# Altium project triumvi_integrated.PrjPcb
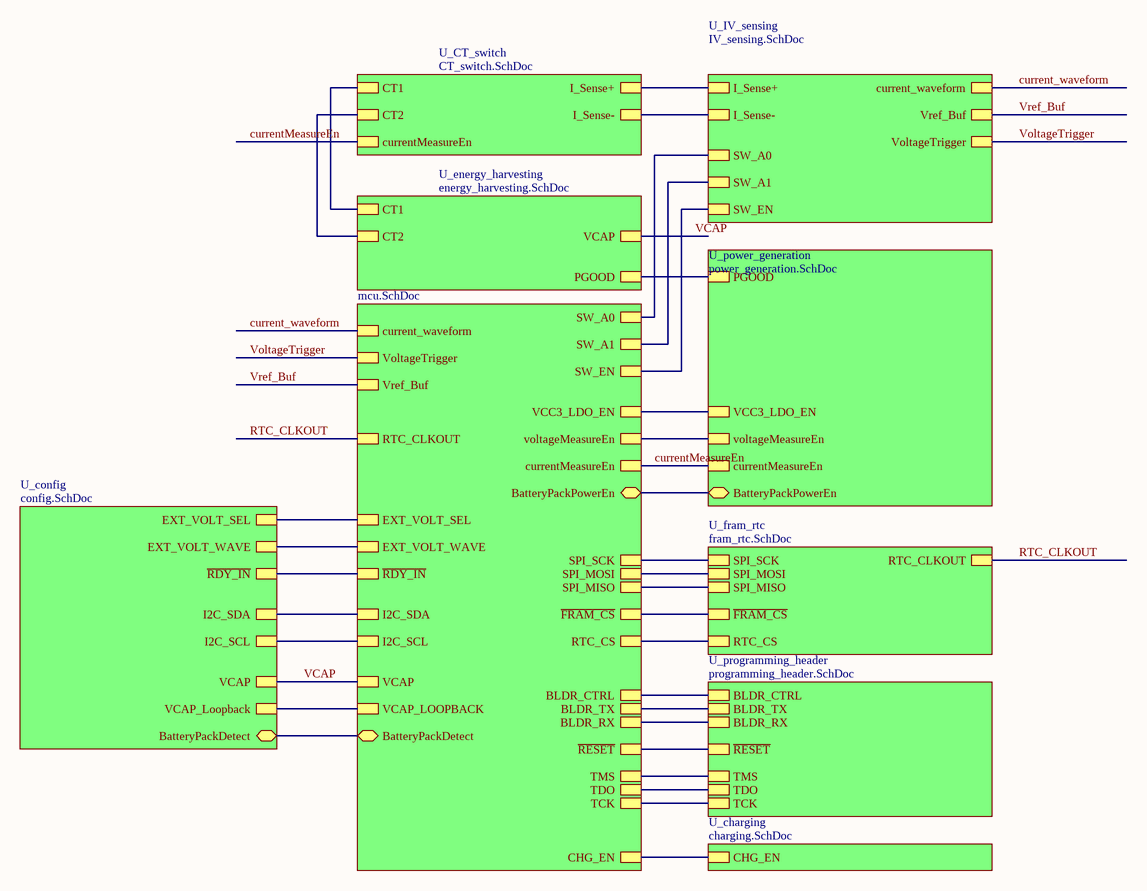
[diagram p0: top.SchDoc]
10 sheets, 152 parts. Net scope: hierarchical (ports join the sheet entries above them; power ports are global).
Board files: triumvi_integrated.PcbDoc, triumvi_integrated_array.PcbDoc, triumvi_integrated_small.PcbDoc
Sheets:
  top.SchDoc
    U_mcu = mcu.SchDoc
    U_charging = charging.SchDoc
    U_config = config.SchDoc
    U_CT_switch = CT_switch.SchDoc
    U_energy_harvesting = energy_harvesting.SchDoc
    U_fram_rtc = fram_rtc.SchDoc
    U_IV_sensing = IV_sensing.SchDoc
    U_power_generation = power_generation.SchDoc
    U_programming_header = programming_header.SchDoc

## Sheet top.SchDoc: Triumvi - Top
size Letter; Author: Ye-Sheng Kuo; Revision: 11; SheetNumber: 1; SheetTotal: 10

### Sub-sheets
U_charging = charging.SchDoc: CHG_EN
U_config = config.SchDoc: VCAP_Loopback, VCAP, EXT_VOLT_WAVE, EXT_VOLT_SEL, I2C_SDA, I2C_SCL, ~{RDY_IN}, BatteryPackDetect
U_CT_switch = CT_switch.SchDoc: CT1, CT2, currentMeasureEn, I_Sense+, I_Sense-
U_energy_harvesting = energy_harvesting.SchDoc: CT1, CT2, PGOOD, VCAP
U_fram_rtc = fram_rtc.SchDoc: SPI_MOSI, SPI_SCK, SPI_MISO, RTC_CS, ~{FRAM_CS}, RTC_CLKOUT
U_IV_sensing = IV_sensing.SchDoc: current_waveform, Vref_Buf, VoltageTrigger, I_Sense+, I_Sense-, SW_A0, SW_A1, SW_EN
U_mcu = mcu.SchDoc: current_waveform, Vref_Buf, voltageMeasureEn, currentMeasureEn, VoltageTrigger, ~{FRAM_CS}, SPI_SCK, SPI_MOSI, SPI_MISO, RTC_CS, I2C_SCL, I2C_SDA, EXT_VOLT_SEL, EXT_VOLT_WAVE, TDO, BLDR_CTRL, BLDR_TX, BLDR_RX, ~{RESET}, TMS, TCK, VCC3_LDO_EN, VCAP_LOOPBACK, VCAP, ~{RDY_IN}, SW_EN, RTC_CLKOUT, SW_A0, SW_A1, CHG_EN, BatteryPackPowerEn, BatteryPackDetect
U_power_generation = power_generation.SchDoc: PGOOD, VCC3_LDO_EN, voltageMeasureEn, currentMeasureEn, BatteryPackPowerEn
U_programming_header = programming_header.SchDoc: ~{RESET}, TMS, TCK, TDO, BLDR_CTRL, BLDR_TX, BLDR_RX

### Nets
BatteryPackDetect: sheet U_mcu/BatteryPackDetect, sheet U_config/BatteryPackDetect
BLD_CTRL: sheet U_mcu/BLDR_CTRL, sheet U_programming_header/BLDR_CTRL
BLD_RX: sheet U_mcu/BLDR_RX, sheet U_programming_header/BLDR_RX
BLD_TX: sheet U_mcu/BLDR_TX, sheet U_programming_header/BLDR_TX
CT1: sheet U_CT_switch/CT1, sheet U_energy_harvesting/CT1
CT2: sheet U_CT_switch/CT2, sheet U_energy_harvesting/CT2
current_waveform: sheet U_mcu/current_waveform, sheet U_IV_sensing/current_waveform
currentMeasureEn: sheet U_mcu/currentMeasureEn, sheet U_CT_switch/currentMeasureEn, sheet U_power_generation/currentMeasureEn
EXT_VOLT_SEL: sheet U_mcu/EXT_VOLT_SEL, sheet U_config/EXT_VOLT_SEL
EXT_VOLT_WAVE: sheet U_mcu/EXT_VOLT_WAVE, sheet U_config/EXT_VOLT_WAVE
I2C_SCL: sheet U_mcu/I2C_SCL, sheet U_config/I2C_SCL
I2C_SDA: sheet U_mcu/I2C_SDA, sheet U_config/I2C_SDA
in+: sheet U_CT_switch/I_Sense+, sheet U_IV_sensing/I_Sense+
in-: sheet U_CT_switch/I_Sense-, sheet U_IV_sensing/I_Sense-
PGOOD: sheet U_energy_harvesting/PGOOD, sheet U_power_generation/PGOOD
~{RDY_IN}: sheet U_mcu/~{RDY_IN}, sheet U_config/~{RDY_IN}
~{RESET}: sheet U_mcu/~{RESET}, sheet U_programming_header/~{RESET}
RTC_CLKOUT: sheet U_mcu/RTC_CLKOUT, sheet U_fram_rtc/RTC_CLKOUT
RTC_CS: sheet U_mcu/RTC_CS, sheet U_fram_rtc/RTC_CS
SPI_CLK: sheet U_mcu/SPI_SCK, sheet U_fram_rtc/SPI_SCK
SPI_MISO: sheet U_mcu/SPI_MISO, sheet U_fram_rtc/SPI_MISO
SPI_MOSI: sheet U_mcu/SPI_MOSI, sheet U_fram_rtc/SPI_MOSI
SW_A0: sheet U_mcu/SW_A0, sheet U_IV_sensing/SW_A0
SW_A1: sheet U_mcu/SW_A1, sheet U_IV_sensing/SW_A1
SW_EN: sheet U_mcu/SW_EN, sheet U_IV_sensing/SW_EN
TCK: sheet U_mcu/TCK, sheet U_programming_header/TCK
TDO: sheet U_mcu/TDO, sheet U_programming_header/TDO
TMS: sheet U_mcu/TMS, sheet U_programming_header/TMS
VCAP: sheet U_mcu/VCAP, sheet U_config/VCAP, sheet U_energy_harvesting/VCAP
VCAP_LOOPBACK: sheet U_mcu/VCAP_LOOPBACK, sheet U_config/VCAP_Loopback
voltageMeasureEn: sheet U_mcu/voltageMeasureEn, sheet U_power_generation/voltageMeasureEn
VoltageTrigger: sheet U_mcu/VoltageTrigger, sheet U_IV_sensing/VoltageTrigger
Vref_Buf: sheet U_mcu/Vref_Buf, sheet U_IV_sensing/Vref_Buf
NetQ13_5: sheet U_mcu/BatteryPackPowerEn, sheet U_power_generation/BatteryPackPowerEn
NetR4_1: sheet U_mcu/CHG_EN, sheet U_charging/CHG_EN
NetU5_1: sheet U_mcu/~{FRAM_CS}, sheet U_fram_rtc/~{FRAM_CS}
NetU10_11: sheet U_mcu/VCC3_LDO_EN, sheet U_power_generation/VCC3_LDO_EN

### Notes on the sheet
- Title
- Date:
- Author:
- Revision:
- Sheet
- of
- University of Michigan
- File:

## Sheet mcu.SchDoc: Triumvi - CC2538
size Letter; Author: Ye-Sheng Kuo; Revision: 11; SheetNumber: 7; SheetTotal: 10
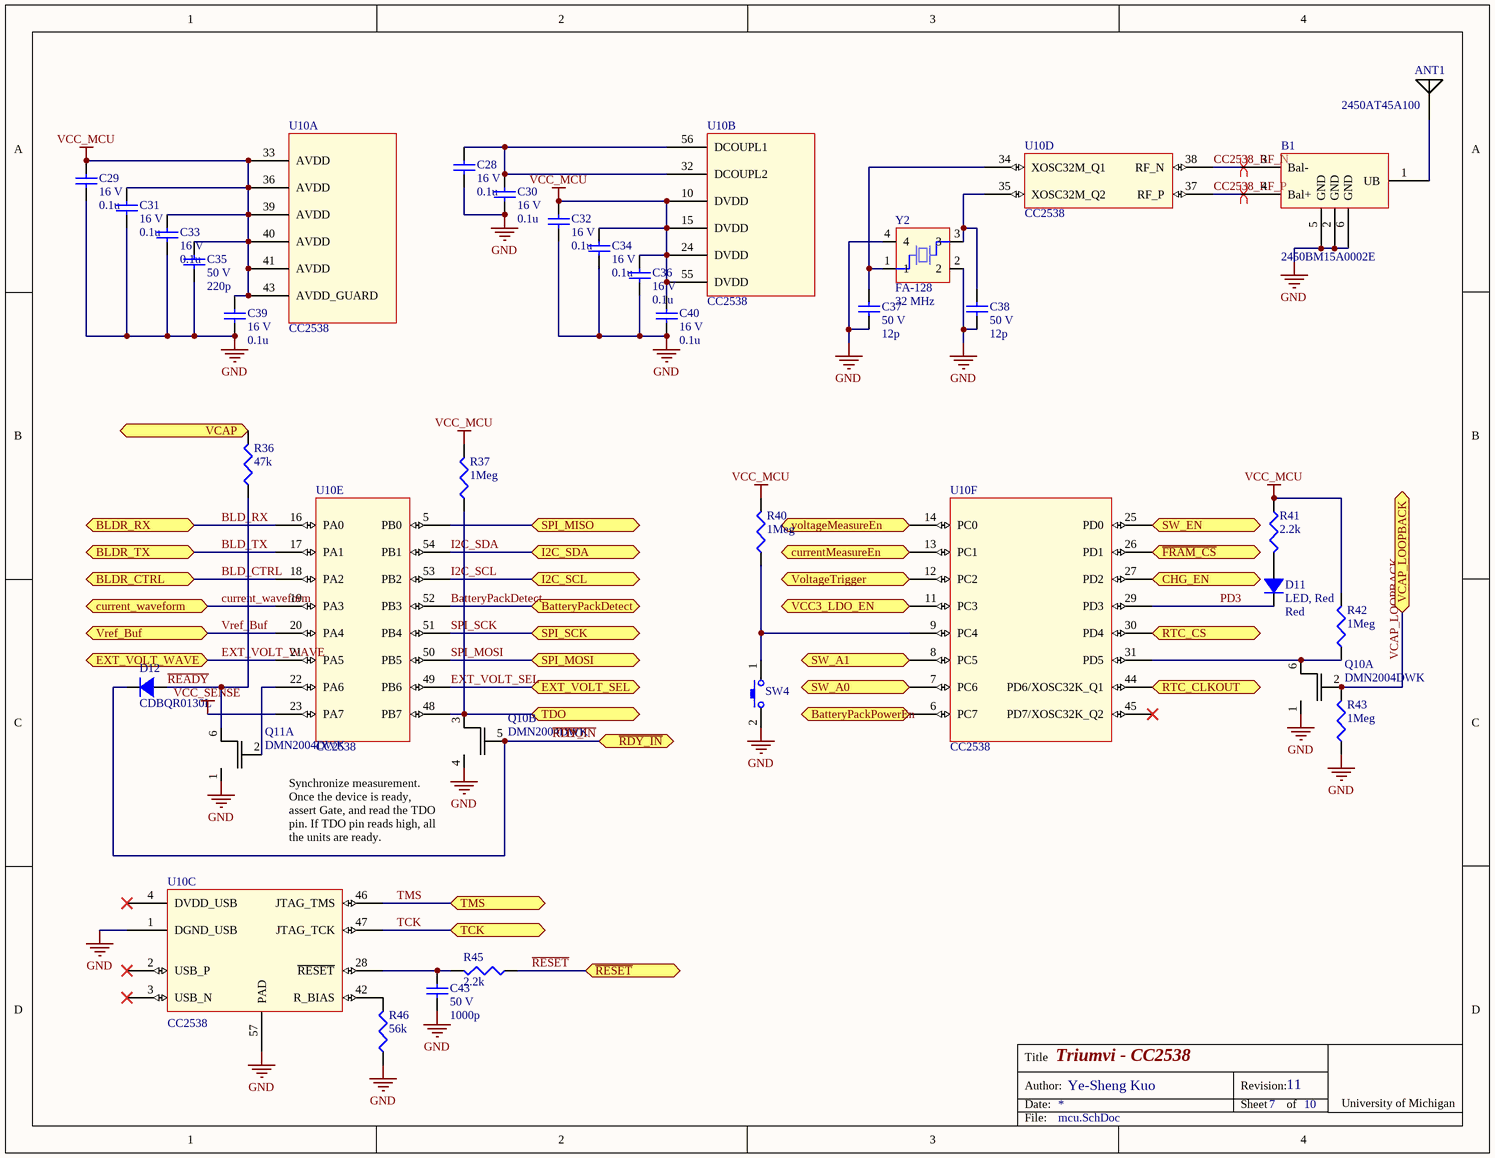
[diagram p1: mcu.SchDoc]

### Parts
ANT1  2450AT45A100  [2450AT45A100]
B1  2450BM15A0002E  [2450BM15A0002]
C28  voltage rated: 16 V  [0402]  (hidden comment: 0.1u)
C29  voltage rated: 16 V  [0402]  (hidden comment: 0.1u)
C30  voltage rated: 16 V  [0402]  (hidden comment: 0.1u)
C31  voltage rated: 16 V  [0402]  (hidden comment: 0.1u)
C32  voltage rated: 16 V  [0402]  (hidden comment: 0.1u)
C33  voltage rated: 16 V  [0402]  (hidden comment: 0.1u)
C34  voltage rated: 16 V  [0402]  (hidden comment: 0.1u)
C35  voltage rated: 50 V  [0402]  (hidden comment: 220p)
C36  voltage rated: 16 V  [0402]  (hidden comment: 0.1u)
C37  voltage rated: 50 V  [0402]  (hidden comment: 12p)
C38  voltage rated: 50 V  [0402]  (hidden comment: 12p)
C39  voltage rated: 16 V  [0402]  (hidden comment: 0.1u)
C40  voltage rated: 16 V  [0402]  (hidden comment: 0.1u)
C43  voltage rated: 50 V  [0402]  (hidden comment: 1000p)
D11  LED, Red  value Red  [0402 - LED]
D12  CDBQR0130L  [0402 - DIODE]
Q10  DMN2004DWK  [SC70-6]  (parts A,B of 2)
Q11  DMN2004DWK  [SC70-6]  (part A of 2)
R36  47k  [0402]
R37  1Meg  [0402]
R40  1Meg  [0402]
R41  2.2k  [0402]
R42  1Meg  [0402]
R43  1Meg  [0402]
R45  2.2k  [0402]
R46  56k  [0402]
SW4  EVQP7C  [EVQP7C]  (value not drawn)
U10  CC2538  [QFN56]  (parts A,B,C,D,E,F of 6)
Y2  FA-128  frequency: 32 MHz  [FA-128]

### Ports
BatteryPackDetect, BatteryPackPowerEn, BLDR_CTRL, BLDR_RX, BLDR_TX, CHG_EN, current_waveform, currentMeasureEn, EXT_VOLT_SEL, EXT_VOLT_WAVE, I2C_SCL, I2C_SDA, RTC_CLKOUT, RTC_CS, SPI_MISO, SPI_MOSI, SPI_SCK, SW_A0, SW_A1, SW_EN, TCK, TDO, TMS, VCAP, VCAP_LOOPBACK, VCC3_LDO_EN, voltageMeasureEn, VoltageTrigger, Vref_Buf, ~{FRAM_CS}, ~{RDY_IN}, ~{RESET}

### Nets
GND: B1.2(GND) B1.5(GND) B1.6(GND) C28.2 C29.2 C30.2 C31.2 C32.2 C33.2 C34.2 C35.2 C36.2 C37.2 C38.2 C39.2 C40.2 C43.2 Q10.1(S2) Q10.4(S1) Q11.1(S2) R43.2 R46.2 SW4.2 U10.1(DGND_USB) U10.57(PAD) Y2.2 Y2.4
VCC_MCU: C29.1 C31.1 C32.1 C33.1 C34.1 C35.1 C36.1 C39.1 C40.1 R37.1 R40.1 R41.2 R42.1 U10.10(DVDD) U10.15(DVDD) U10.24(DVDD) U10.33(AVDD) U10.36(AVDD) U10.39(AVDD) U10.40(AVDD) U10.41(AVDD) U10.43(AVDD_GUARD) U10.55(DVDD)
VCC_SENSE: U10.23(PA7)
BatteryPackDetect: U10.52(PB3) ; port BatteryPackDetect
BLD_CTRL: U10.18(PA2) ; port BLDR_CTRL
BLD_RX: U10.16(PA0) ; port BLDR_RX
BLD_TX: U10.17(PA1) ; port BLDR_TX
CC2538_RF_N: B1.3(Bal-) U10.38(RF_N)
CC2538_RF_P: B1.4(Bal+) U10.37(RF_P)
current_waveform: U10.19(PA3) ; port current_waveform
currentMeasureEn: U10.13(PC1) ; port currentMeasureEn
EXT_VOLT_SEL: U10.49(PB6) ; port EXT_VOLT_SEL
EXT_VOLT_WAVE: U10.21(PA5) ; port EXT_VOLT_WAVE
I2C_SCL: U10.53(PB2) ; port I2C_SCL
I2C_SDA: U10.54(PB1) ; port I2C_SDA
PD3: D11.2 U10.29(PD3)
~{RDY_IN}: D12.2 Q10.5(G1) ; port ~{RDY_IN}  [also labelled TDO]
~{READY}: D12.1 Q11.6(D2) R36.2
~{RESET}: R45.2 ; port ~{RESET}
RTC_CLKOUT: U10.44(PD6/XOSC32K_Q1) ; port RTC_CLKOUT
RTC_CS: U10.30(PD4) ; port RTC_CS
SPI_MISO: U10.5(PB0) ; port SPI_MISO
SPI_MOSI: U10.50(PB5) ; port SPI_MOSI
SPI_SCK: U10.51(PB4) ; port SPI_SCK  [project net SPI_CLK]
SW_A0: U10.7(PC6) ; port SW_A0
SW_A1: U10.8(PC5) ; port SW_A1
SW_EN: U10.25(PD0) ; port SW_EN
TCK: U10.47(JTAG_TCK) ; port TCK
TDO: Q10.3(D1) R37.2 U10.48(PB7) ; port TDO
TMS: U10.46(JTAG_TMS) ; port TMS
VCAP: R36.1 ; port VCAP
VCAP_LOOPBACK: Q10.2(G2) R43.1 ; port VCAP_LOOPBACK
voltageMeasureEn: U10.14(PC0) ; port voltageMeasureEn
VoltageTrigger: U10.12(PC2) ; port VoltageTrigger
Vref_Buf: U10.20(PA4) ; port Vref_Buf
NetANT1_1: ANT1.1 B1.1(UB)
NetC28_1: C28.1 C30.1 U10.32(DCOUPL2) U10.56(DCOUPL1)
NetC37_1: C37.1 U10.34(XOSC32M_Q1) Y2.1
NetC38_1: C38.1 U10.35(XOSC32M_Q2) Y2.3
NetC43_1: C43.1 R45.1 U10.28(~{RESET})
NetD11_1: D11.1 R41.1
NetQ10_6: Q10.6(D2) R42.2 U10.31(PD5)
NetQ11_2: Q11.2(G2) U10.22(PA6)
NetQ13_5: U10.6(PC7) ; port BatteryPackPowerEn
NetR4_1: U10.27(PD2) ; port CHG_EN
NetR40_2: R40.2 SW4.1 U10.9(PC4)
NetR46_1: R46.1 U10.42(R_BIAS)
NetU5_1: U10.26(PD1) ; port ~{FRAM_CS}
NetU10_11: U10.11(PC3) ; port VCC3_LDO_EN

Not connected (* = marked no-connect by the designer): U10 2(USB_P)* 3(USB_N)* 4(DVDD_USB)* 45(PD7/XOSC32K_Q2)*

### Layout directives
differential pair: CC2538_RF_N, CC2538_RF_P

### Notes on the sheet
- Synchronize measurement. Once the device is ready, assert Gate, and read the TDO pin. If TDO pin reads high, all the units are ready.
- Title
- Date:
- Author:
- Revision:
- Sheet
- of
- University of Michigan
- File:

### Library data of the parts
ANT1 = 2450AT45A100: 2.45 GHz High Gain SMD Chip Antenna; Supplier 1: Digi-Key; Supplier Part Number 1: 712-1012-1-ND
B1 = 2450BM15A0002E: 2.45 GHz Balun for TI CC253X; Supplier 1: Digi-Key; Supplier Part Number 1: 712-1536-1-ND
C28-C34 C36 C39 C40 = GRM155R71C104KA88D: 0.10µF ±10% 16V Ceramic Capacitor X7R 0402; Manufacture: Murata; tolerance: 10%; package: 0402; Supplier 1: Digi-Key; Supplier Part Number 1: 490-3261-1-ND; Value: 0.1u; Temperature Coefficient: X7R; Manufacturer Part Number: GRM155R71C104KA88D
C35 = C0402C221K5RACTU: 220pF ±10% 50V Ceramic Capacitor X7R 0402; Manufacture: Kemet; tolerance: 10%; package: 0402; Supplier 1: Digi-Key; Supplier Part Number 1: 399-1030-1-ND; Value: 220p; Temperature Coefficient: X7R; Manufacturer Part Number: C0402C221K5RACTU
C37 C38 = 500R07S120GV4T: 12pF ±2% 50V Ceramic Capacitor C0G, NP0 0402; Manufacture: Johanson Technology Inc.; tolerance: 2%; package: 0402; Temperature Coefficient: C0G, NP0; Manufacturer Part Number: 500R07S120GV4T; Supplier 1: Digi-Key; Supplier Part Number 1: 712-1256-1-ND; Value: 12p
C43 = C1005C0G1H102J050BA: 1000pF ±5% 50V Ceramic Capacitor C0G, NP0 0402; Manufacture: TDK; tolerance: 5%; package: 0402; Supplier 1: Digi-Key; Supplier Part Number 1: 445-6846-1-ND; Value: 1000p; Temperature Coefficient: C0G, NP0; Manufacturer Part Number: C1005C0G1H102J050BA
D11 = SML-P12UTT86: Red 620nm LED Indication - Discrete 2V 2-SMD; Manufacturer: Rohm Semiconductor; Current @ VF: 20 mA; package: 0402; Supplier 1: Digi-Key; Supplier Part Number 1: 511-1593-1-ND; Forward Voltage: 2 V; Manufacturer Part Number: SML-P12UTT86; Wavelength: 620 nm
D12 = CDBQR0130L: Diode Schottky 30V 100mA Surface Mount 0402/SOD-923F; Manufacturer: Comchip Technology; Forward Voltage @ If: 350 mV @ 10 mA; Supplier 1: Digi-Key; Supplier Part Number 1: 641-1271-1-ND; Manufacturer Part Number: CDBQR0130L; current: 100 mA; reverse voltage: 30 V; diode type: Schottky
Q10 Q11 = DMN2004DWK: DUAL N-CHANNEL ENHANCEMENT MODE MOSFET; Supplier 1: Digi-Key; Supplier Part Number 1: DMN2004DWKDICT-ND
R36 = CRCW040247K0FKED: RES SMD 47K OHM 1% 1/16W 0402; Manufacturer: Vishay Dale; Temperature Coefficient: 100 ppm/C; Tolerance: 1%; Power: 1/16 W; package: 0402; Supplier 1: Digi-Key; Supplier Part Number 1: 541-47.0KLCT-ND; value: 47k; Manufacturer Part Number: CRCW040247K0FKED
R37 R40 R42 R43 = CRCW04021M00FKED: RES SMD 1M OHM 1% 1/16W 0402; Manufacturer: Vishay Dale; Temperature Coefficient: 100 ppm/C; Tolerance: 1%; Power: 1/16 W; Supplier 1: Digi-Key; Supplier Part Number 1: 541-1.00MLCT-ND; package: 0402; value: 1Meg; Manufacturer Part Number: CRCW04021M00FKED
R41 R45 = CRCW04022K20FKED: RES SMD 2.2K OHM 1% 1/16W 0402; Manufacturer: Vishay Dale; Temperature Coefficient: 100 ppm/C; Tolerance: 1%; Power: 1/16 W; package: 0402; Supplier 1: Digi-Key; Supplier Part Number 1: 541-2.20KLCT-ND; value: 2.2k; Manufacturer Part Number: CRCW04022K20FKED
R46 = CRCW040256K0FKED: RES SMD 56K OHM 1% 1/16W 0402; Manufacturer: Vishay Dale; Temperature Coefficient: 100 ppm/C; Power: 1/16 W; package: 0402; Supplier 1: Digi-Key; Supplier Part Number 1: 541-56.0KLCT-ND; Tolerance: 1%; value: 56k; Manufacturer Part Number: CRCW040256K0FKED
SW4 = EVQP7C: 3.5 mm×2.9 mm Side-operational SMD  Light Touch Switches; Supplier 1: Digi-Key; Supplier Part Number 1: P16769CT-ND
U10 = CC2538: A Powerful System-On-Chip for 2.4-GHz IEEE 802.15.4, 6LoWPAN  and ZigBee Applications; Supplier 1: Digi-Key; Supplier Part Number 1: 296-35797-1-ND
Y2 = FA-128: MHz Range Crystal Unit; Load capatance: 10 pF; ESR: 60; stability: 20 ppm; Supplier 1: Digi-Key; Supplier Part Number 1: SER3800CT-ND

## Sheet charging.SchDoc: Triumvi - Charging
size Letter; Author: Ye-Sheng Kuo; Revision: 11; SheetNumber: 6; SheetTotal: 10
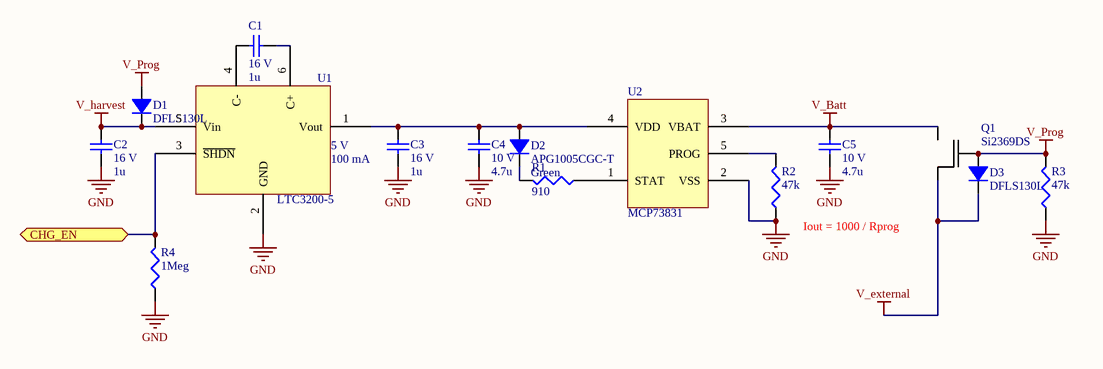
[diagram p2: charging.SchDoc]

### Parts
C1  voltage rated: 16 V  [0603]  (hidden comment: 1u)
C2  voltage rated: 16 V  [0603]  (hidden comment: 1u)
C3  voltage rated: 16 V  [0603]  (hidden comment: 1u)
C4  voltage rated: 10 V  [0603]  (hidden comment: 4.7u)
C5  voltage rated: 10 V  [0603]  (hidden comment: 4.7u)
D1  DFLS130L  [PowerDI123]
D2  APG1005CGC-T  value Green  [0402 - LED]
D3  DFLS130L  [PowerDI123]
Q1  Si2369DS  [SOT23-3]
R1  910  [0402]
R2  47k  [0402]
R3  47k  [0402]
R4  1Meg  [0402]
U1  LTC3200-5  Vout: 5 V  Iout: 100 mA  [SOT23-6]
U2  MCP73831  [TSOT23-5]

### Ports
CHG_EN

### Nets
GND: C2.1 C3.1 C4.2 C5.2 R2.2 R3.2 R4.2 U1.2(GND) U2.2(VSS)
V_Batt: C5.1 Q1.2(S) U2.3(VBAT)
V_external: D3.2 Q1.3(D)
V_harvest: C2.2 D1.2 U1.5(Vin)
V_Prog: D1.1 D3.1 Q1.1(G) R3.1
NetC1_1: C1.1 U1.4(C-)
NetC1_2: C1.2 U1.6(C+)
NetC3_2: C3.2 C4.1 D2.1 U1.1(Vout) U2.4(VDD)
NetD2_2: D2.2 R1.1
NetR1_2: R1.2 U2.1(STAT)
NetR2_1: R2.1 U2.5(PROG)
NetR4_1: R4.1 U1.3(~{SHDN}) ; port CHG_EN

### Notes on the sheet
- (near R2) Iout = 1000 / Rprog
- Title
- Date:
- Author:
- Revision:
- Sheet
- of
- University of Michigan
- File:

### Library data of the parts
C1-C3 = C1608X7R1C105K080AC: 1µF ±10% 16V Ceramic Capacitor X7R 0603; Manufacture: TDK; tolerance: 10%; package: 0603; Temperature Coefficient: X7R; Manufacturer Part Number: C1608X7R1C105K080AC; Supplier 1: Digi-Key; Supplier Part Number 1: 445-1604-1-ND; Value: 1u
C4 C5 = CGB3B1X5R1A475K055AC: 4.7µF ±10% 10V Ceramic Capacitor X5R 0603; Manufacture: TDK; tolerance: 10%; package: 0603; Supplier 1: Digi-Key; Supplier Part Number 1: 445-7482-1-ND; Value: 4.7u; Temperature Coefficient: X5R; Manufacturer Part Number: CGB3B1X5R1A475K055AC
D1 D3 = DFLS130L: 1.0A SURFACE MOUNT SCHOTTKY BARRIER RECTIFIER; Manufacturer: Diodes Incorporated; Forward Voltage @ If: 0.21 V @ 0.1 A; reverse current: 0.26 mA @ 5V; power: 556 mW; Manufacturer Part Number: DFLS130L; diode type: SCHOTTKY BARRIER; Supplier 1: Digi-Key; Supplier Part Number 1: DFLS130LDICT-ND
D2 = APG1005CGC-T: Green 571nm LED Indication - Discrete 2V 0402 (1005 Metric); Manufacturer: Kingbright; Current @ VF: 20 mA; package: 0402; Forward Voltage: 2 V; Manufacturer Part Number: APG1005CGC-T; Wavelength: 571 nm; Supplier 1: Digi-Key; Supplier Part Number 1: 754-1811-1-ND
Q1 = Si2369DS: P-Channel 30-V (D-S) MOSFET; Supplier 1: Digi-Key; Supplier Part Number 1: SI2369DS-T1-GE3CT-ND
R1 = CRCW0402910RFKED: RES SMD 910 OHM 1% 1/16W 0402; Manufacturer: Vishay Dale; Temperature Coefficient: 100 ppm/C; Tolerance: 1%; Power: 1/16 W; package: 0402; Supplier 1: Digi-Key; Supplier Part Number 1: 541-910LCT-ND; value: 910; Manufacturer Part Number: CRCW0402910RFKED
R2 R3 = CRCW040247K0FKED: as R36 on sheet mcu; Tolerance: 1%; Power: 1/16 W; package: 0402; Supplier 1: Digi-Key; Supplier Part Number 1: 541-47.0KLCT-ND; value: 47k; Manufacturer Part Number: CRCW040247K0FKED
R4 = CRCW04021M00FKED: as R37 on sheet mcu; Tolerance: 1%; Power: 1/16 W; Supplier 1: Digi-Key; Supplier Part Number 1: 541-1.00MLCT-ND; package: 0402; value: 1Meg; Manufacturer Part Number: CRCW04021M00FKED
U1 = LTC3200ES6-5#TRMPBF: Low Noise, Regulated   Charge Pump DC/DC Converters; Supplier 1: Digi-Key; Supplier Part Number 1: LTC3200ES6-5#TRMPBFCT-ND
U2 = MCP73831: Miniature Single-Cell, Fully Integrated Li-Ion,  Li-Polymer Charge Management Controllers; Supplier 1: Digi-Key; Supplier Part Number 1: MCP73831T-2ATI/OTCT-ND

## Sheet config.SchDoc: Triumvi - Configuring
size Letter; Author: Ye-Sheng Kuo; Revision: 11; SheetNumber: 8; SheetTotal: 10
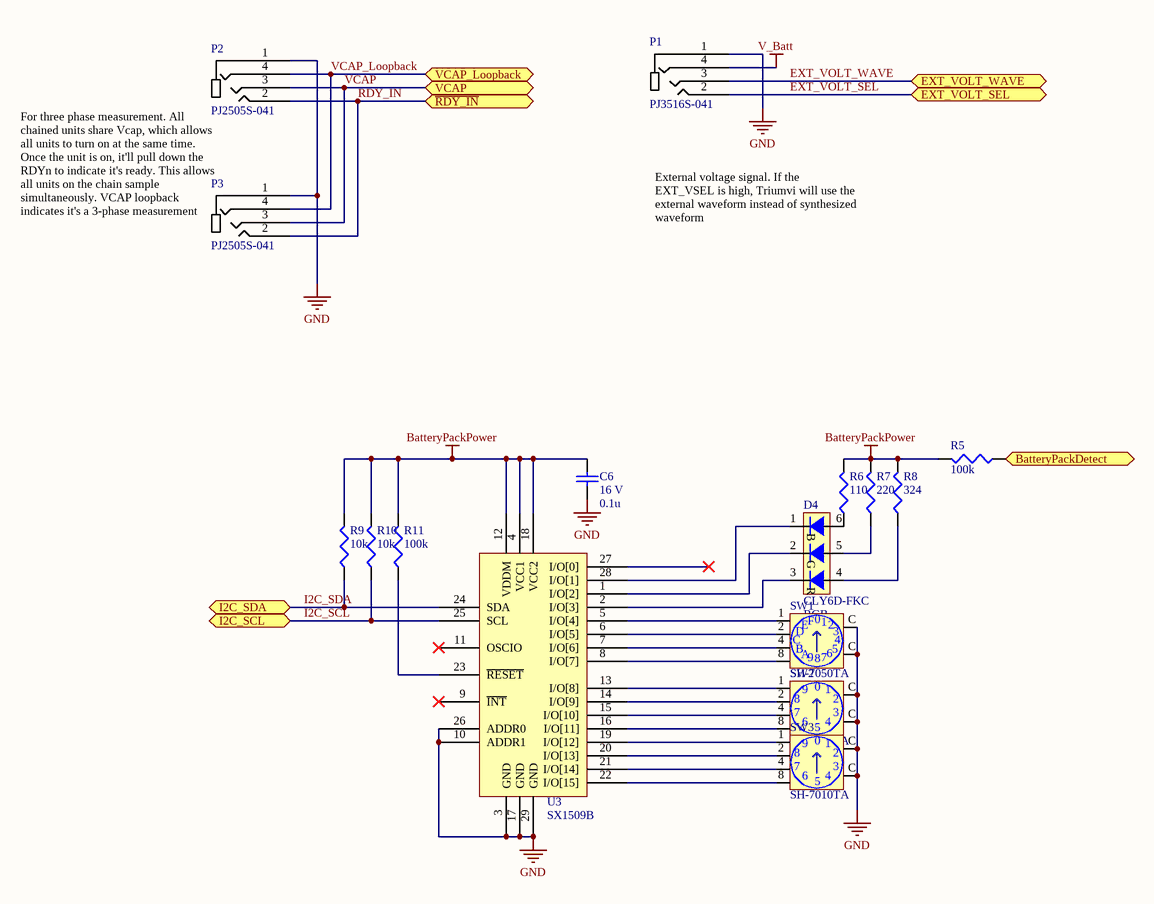
[diagram p3: config.SchDoc]

### Parts
C6  voltage rated: 16 V  [0402]  (hidden comment: 0.1u)
D4  CLY6D-FKC  value RGB  [PLCC6]
P1  PJ3516S-041  [PJ3516S-041]
P2  PJ2505S-041  [PJ2505S-041]
P3  PJ2505S-041  [PJ2505S-041]
R5  100k  [0402]
R6  110  [0402]
R7  220  [0402]
R8  324  [0402]
R9  10k  [0402]
R10  10k  [0402]
R11  100k  [0402]
SW1  SH-7050TA  [SH-7050A]
SW2  SH-7010TA  [SH-7010A]
SW3  SH-7010TA  [SH-7010A]
U3  SX1509B  [QFN40P400X400X60_HS-29N]

### Ports
BatteryPackDetect, EXT_VOLT_SEL, EXT_VOLT_WAVE, I2C_SCL, I2C_SDA, VCAP, VCAP_Loopback, ~{RDY_IN}

### Nets
BatteryPackPower: C6.1 R5.1 R6.1 R7.1 R8.1 R9.1 R10.1 R11.1 U3.4(VCC1) U3.12(VDDM) U3.18(VCC2)
GND: C6.2 P1.1 P2.1 P3.1 SW1.C SW2.C SW3.C U3.3(GND) U3.10(ADDR1) U3.17(GND) U3.26(ADDR0) U3.29(GND)
V_Batt: P1.4
BatteryPackDetect: R5.2 ; port BatteryPackDetect
EXT_VOLT_SEL: P1.2 ; port EXT_VOLT_SEL
EXT_VOLT_WAVE: P1.3 ; port EXT_VOLT_WAVE
I2C_SCL: R10.2 U3.25(SCL) ; port I2C_SCL
I2C_SDA: R9.2 U3.24(SDA) ; port I2C_SDA
~{RDY_IN}: P2.2 P3.2 ; port ~{RDY_IN}
VCAP: P2.3 P3.3 ; port VCAP
VCAP_LOOPBACK: P2.4 P3.4 ; port VCAP_Loopback
NetD4_1: D4.1 U3.28(I/O[1])
NetD4_2: D4.2 U3.1(I/O[2])
NetD4_3: D4.3 U3.2(I/O[3])
NetD4_4: D4.4 R8.2
NetD4_5: D4.5 R7.2
NetD4_6: D4.6 R6.2
NetR11_2: R11.2 U3.23(~{RESET})
NetSW1_1: SW1.1 U3.5(I/O[4])
NetSW1_2: SW1.2 U3.6(I/O[5])
NetSW1_4: SW1.4 U3.7(I/O[6])
NetSW1_8: SW1.8 U3.8(I/O[7])
NetSW2_1: SW2.1 U3.13(I/O[8])
NetSW2_2: SW2.2 U3.14(I/O[9])
NetSW2_4: SW2.4 U3.15(I/O[10])
NetSW2_8: SW2.8 U3.16(I/O[11])
NetSW3_1: SW3.1 U3.19(I/O[12])
NetSW3_2: SW3.2 U3.20(I/O[13])
NetSW3_4: SW3.4 U3.21(I/O[14])
NetSW3_8: SW3.8 U3.22(I/O[15])

Not connected (* = marked no-connect by the designer): U3 9(~{INT})* 11(OSCIO)* 27(I/O[0])*

### Notes on the sheet
- For three phase measurement. All chained units share Vcap, which allows all units to turn on at the same time. Once the unit is on, it'll pull down the RDYn to indicate it's ready. This allows all units on the chain sample simultaneously. VCAP loopback indicates it's a 3-phase measurement
- External voltage signal. If the EXT_VSEL is high, Triumvi will use the external waveform instead of synthesized waveform
- Title
- Date:
- Author:
- Revision:
- Sheet
- of
- University of Michigan
- File:
- (in symbol CLY6D-FKC-CK1N1D1BB7D3D3) B; G; R
- (in symbol SH-7010TA) 9; 0; 7; 3; 6; 5
- (in symbol SH-7050TA) F; 0; E; D; 3; B; 5; A; 6; 9; 7

### Library data of the parts
C6 = GRM155R71C104KA88D: as C28 on sheet mcu; tolerance: 10%; package: 0402; Supplier 1: Digi-Key; Supplier Part Number 1: 490-3261-1-ND; Value: 0.1u; Temperature Coefficient: X7R; Manufacturer Part Number: GRM155R71C104KA88D
D4 = CLY6D-FKC-CK1N1D1BB7D3D3: Red, Green, Blue (RGB) 622nm Red, 530nm Green, 470nm Blue LED Indication - Discrete 2.1V Red, 3V Green, 3V Blue 6-SMD, J-Lead; Manufacturer: CREE Inc; Supplier 1: Digi-Key; Supplier Part Number 1: CLY6D-FKC-CK1N1D1BB7D3D3CT-ND; Manufacturer Part Number: CLY6D-FKC-CK1N1D1BB7D3D3; Wavelength: 622nm Red, 530nm Green, 470nm Blue
P1 = PJ3516S-041: 3.5 mm phone jack, 4 terminals
P2 P3 = PJ2505S-041: 2.5 mm phone jack, 4 terminals
R5 R11 = CRCW0402100KFKED: RES SMD 100K OHM 1% 1/16W 0402; Manufacturer: Vishay Dale; Temperature Coefficient: 100 ppm/C; Tolerance: 1%; Power: 1/16 W; package: 0402; Supplier 1: Digi-Key; Supplier Part Number 1: 541-100KLCT-ND; value: 100k; Manufacturer Part Number: CRCW0402100KFKED
R6 = CRCW0402110RFKED: RES SMD 110 OHM 1% 1/16W 0402; Manufacturer: Vishay Dale; Temperature Coefficient: 100 ppm/C; Tolerance: 1%; Power: 1/16 W; package: 0402; Supplier 1: Digi-Key; Supplier Part Number 1: 541-110LCT-ND; value: 110; Manufacturer Part Number: CRCW0402110RFKED
R7 = CRCW0402220RFKED: RES SMD 220 OHM 1% 1/16W 0402; Manufacturer: Vishay Dale; Power: 1/5 W; Temperature Coefficient: 100 ppm; Tolerance: 1%; package: 0402; Supplier 1: Digi-Key; Supplier Part Number 1: 541-220LCT-ND; value: 220; Manufacturer Part Number: CRCW0402220RFKED
R8 = CRCW0402324RFKED: RES SMD 324 OHM 1% 1/16W 0402; Manufacturer: Vishay Dale; Temperature Coefficient: 100 ppm/C; Tolerance: 1%; Power: 1/16 W; package: 0402; Supplier 1: Digi-Key; Supplier Part Number 1: 541-324LCT-ND; value: 324; Manufacturer Part Number: CRCW0402324RFKED
R9 R10 = CRCW040210K0FKED: RES SMD 10K OHM 1% 1/16W 0402; Manufacturer: Vishay Dale; Temperature Coefficient: 100 ppm/C; Tolerance: 1%; Power: 1/16 W; package: 0402; Supplier 1: Digi-Key; Supplier Part Number 1: 541-10.0KLCT-ND; value: 10k; Manufacturer Part Number: CRCW040210K0FKED
SW1 = SH-7050TA: ROTARY CODED SWITCHES; Supplier 1: Digi-Key; Supplier Part Number 1: 563-1213-1-ND
SW2 SW3 = SH-7010TA: ROTARY CODED SWITCHES; Supplier 1: Digi-Key; Supplier Part Number 1: 563-1207-1-ND
U3 = SX1509B: Voltage Level Shifting GPIO  with LED Driver and Keypad Engine; Supplier 1: Digi-Key; Supplier Part Number 1: SX1509BIULCT-ND

## Sheet CT_switch.SchDoc: Triumvi - CT Switching
size Letter; Author: Ye-Sheng Kuo; Revision: 11; SheetNumber: 3; SheetTotal: 10
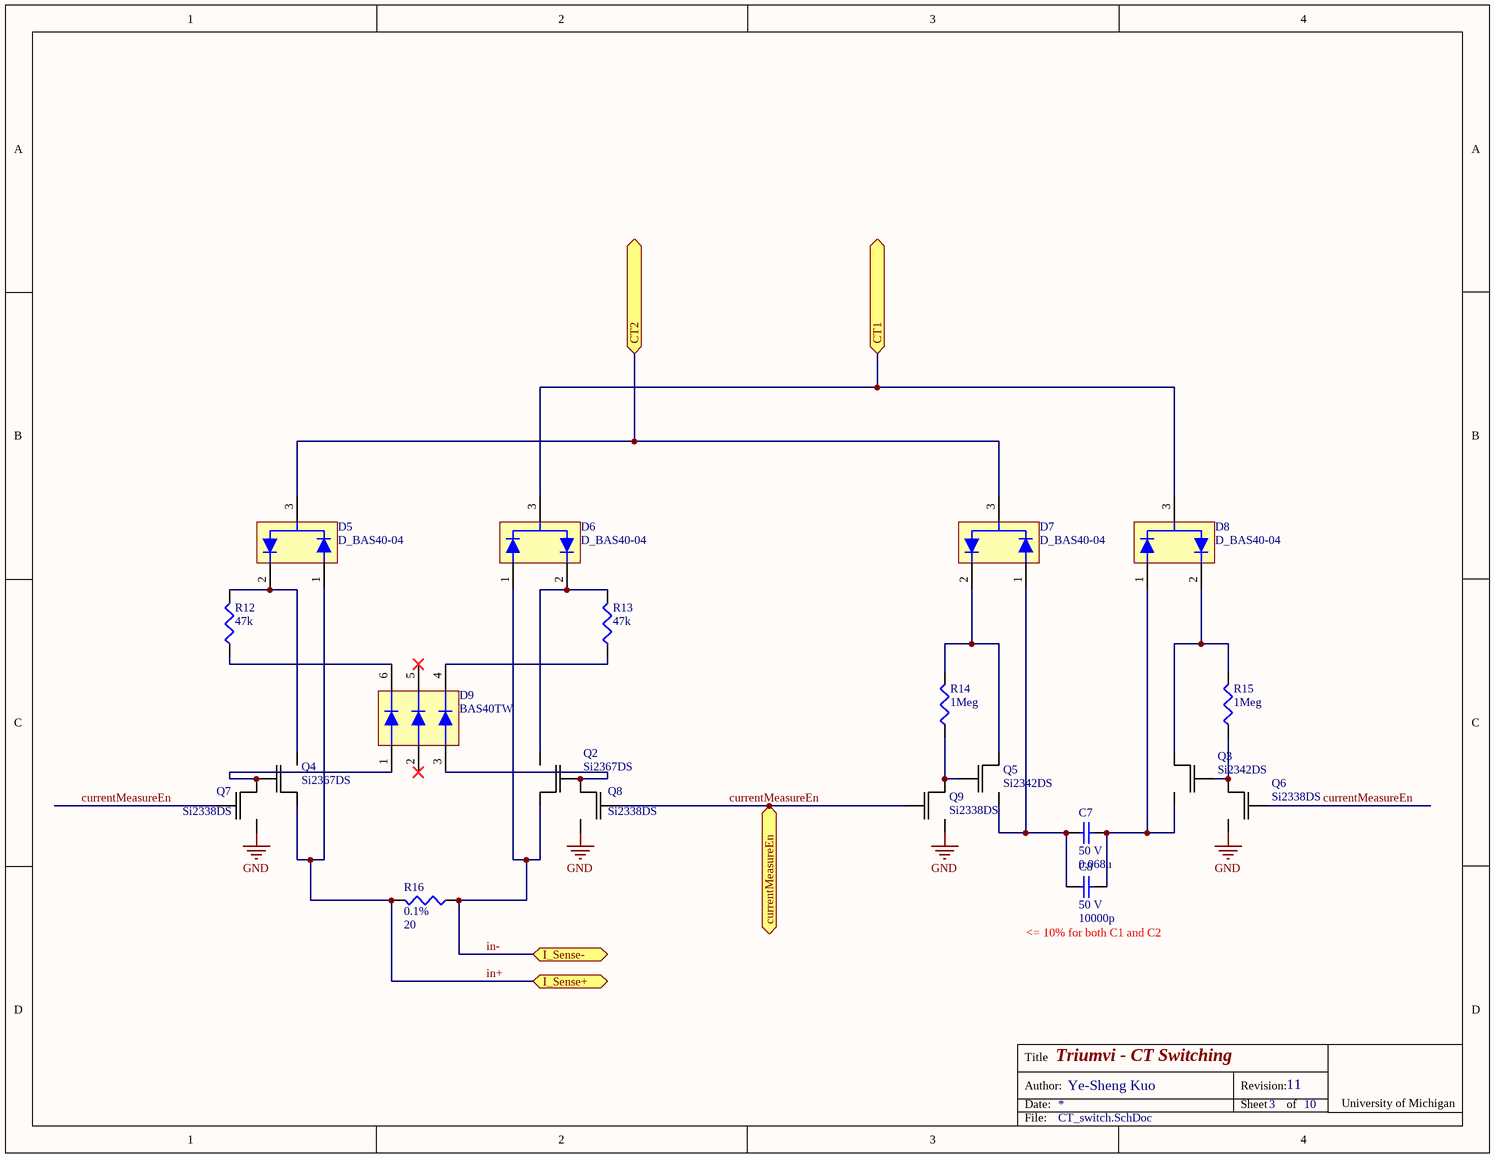
[diagram p4: CT_switch.SchDoc]

### Parts
C7  voltage rated: 50 V  [0603]  (hidden comment: 0.068u)
C8  voltage rated: 50 V  [0603]  (hidden comment: 10000p)
D5  D_BAS40-04  [SOT23-3]
D6  D_BAS40-04  [SOT23-3]
D7  D_BAS40-04  [SOT23-3]
D8  D_BAS40-04  [SOT23-3]
D9  BAS40TW  [SOT-363]
Q2  Si2367DS  [SOT23-3]
Q3  Si2342DS  [SOT23-3]
Q4  Si2367DS  [SOT23-3]
Q5  Si2342DS  [SOT23-3]
Q6  Si2338DS  [SOT23-3]
Q7  Si2338DS  [SOT23-3]
Q8  Si2338DS  [SOT23-3]
Q9  Si2338DS  [SOT23-3]
R12  47k  [0402]
R13  47k  [0402]
R14  1Meg  [0402]
R15  1Meg  [0402]
R16  Tolerance: 0.1%  [0805]  (hidden comment: 20)

### Ports
CT1, CT2, currentMeasureEn, I_Sense+, I_Sense-

### Nets
GND: Q6.2(S) Q7.2(S) Q8.2(S) Q9.2(S)
CT1: D6.3 D8.3 ; port CT1
CT2: D5.3 D7.3 ; port CT2
currentMeasureEn: Q6.1(G) Q7.1(G) Q8.1(G) Q9.1(G) ; port currentMeasureEn
in+: D5.1 Q4.3(D) R16.1 ; port I_Sense+
in-: D6.1 Q2.3(D) R16.2 ; port I_Sense-
NetC7_1: C7.1 C8.1 D7.1 Q5.2(S)
NetC7_2: C7.2 C8.2 D8.1 Q3.2(S)
NetD5_2: D5.2 Q4.2(S) R12.1
NetD6_2: D6.2 Q2.2(S) R13.1
NetD7_2: D7.2 Q5.3(D) R14.1
NetD8_2: D8.2 Q3.3(D) R15.1
NetD9_1: D9.1 Q4.1(G) Q7.3(D)
NetD9_3: D9.3 Q2.1(G) Q8.3(D)
NetD9_4: D9.4 R13.2
NetD9_6: D9.6 R12.2
NetQ3_1: Q3.1(G) Q6.3(D) R15.2
NetQ5_1: Q5.1(G) Q9.3(D) R14.2

Not connected (* = marked no-connect by the designer): D9 2* 5*

### Notes on the sheet
- (near C8) <= 10% for both C1 and C2
- Title
- Date:
- Author:
- Revision:
- Sheet
- of
- University of Michigan
- File:

### Library data of the parts
C7 = C0603C683K5RACTU: 0.068µF ±10% 50V Ceramic Capacitor X7R 0603; Manufacture: Kemet; tolerance: 10%; package: 0603; Supplier 1: Digi-Key; Supplier Part Number 1: 399-7955-1-ND; Value: 0.068u; Temperature Coefficient: X7R; Manufacturer Part Number: C0603C683K5RACTU
C8 = C0603C103J5RACTU: 10000pF ±5% 50V Ceramic Capacitor X7R 0603; Manufacture: Kemet; tolerance: 5%; package: 0603; Supplier 1: Digi-Key; Supplier Part Number 1: 399-1092-6-ND; Value: 10000p; Temperature Coefficient: X7R; Manufacturer Part Number: C0603C103J5RACTU
D5-D8 = D_BAS40-04: SURFACE MOUNT SCHOTTKY BARRIER DIODE; Supplier 1: Digi-Key; Supplier Part Number 1: BAS40-04FDICT-ND
D9 = D_BAS40TW: SURFACE MOUNT SCHOTTKY BARRIER DIODE ARRAYS; Supplier 1: Digi-Key; Supplier Part Number 1: BAS40TW-FDICT-ND
Q2 Q4 = Si2367DS: P-Channel 20 V (D-S) MOSFET; Supplier 1: Digi-Key; Supplier Part Number 1: SI2367DS-T1-GE3CT-ND
Q3 Q5 = Si2342DS: N-Channel 8 V (D-S) MOSFET; Supplier 1: Digi-Key; Supplier Part Number 1: SI2342DS-T1-GE3CT-ND
Q6-Q9 = Si2338DS: N-Channel 30 V (D-S) MOSFET; Supplier 1: Digi-Key; Supplier Part Number 1: SI2338DS-T1-GE3CT-ND
R12 R13 = CRCW040247K0FKED: as R36 on sheet mcu; Tolerance: 1%; Power: 1/16 W; package: 0402; Supplier 1: Digi-Key; Supplier Part Number 1: 541-47.0KLCT-ND; value: 47k; Manufacturer Part Number: CRCW040247K0FKED
R14 R15 = CRCW04021M00FKED: as R37 on sheet mcu; Tolerance: 1%; Power: 1/16 W; Supplier 1: Digi-Key; Supplier Part Number 1: 541-1.00MLCT-ND; package: 0402; value: 1Meg; Manufacturer Part Number: CRCW04021M00FKED
R16 = RTAN0805BKE20R0: RES SMD 20 OHM 0.1% 1/5W 0805; Manufacturer: Stackpole Electronics Inc.; Temperature Coefficient: 25 ppm/C; Power: 0.2 W; package: 0805; Manufacturer Part Number: RTAN0805BKE20R0; Supplier 1: Digi-Key; Supplier Part Number 1: RTAN0805BKE20R0CT-ND; value: 20

## Sheet energy_harvesting.SchDoc: Triumvi - EH
size Letter; Author: Ye-Sheng Kuo; Revision: 11; SheetNumber: 4; SheetTotal: 10
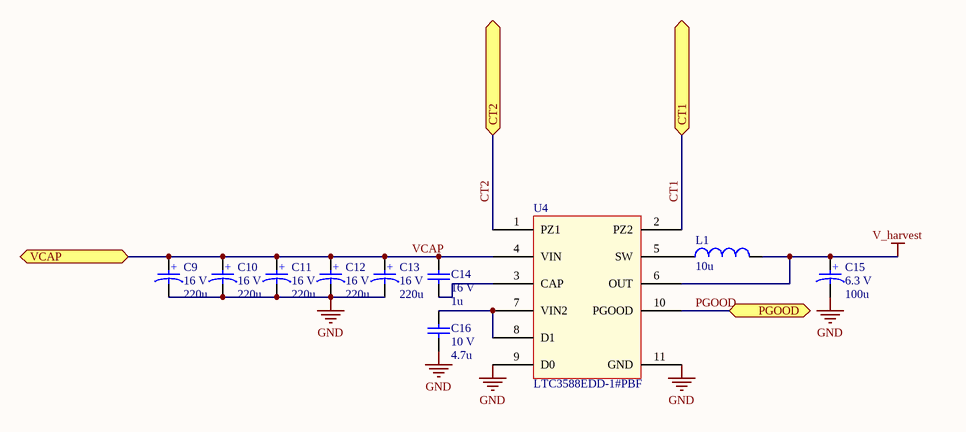
[diagram p5: energy_harvesting.SchDoc]

### Parts
C9  voltage rated: 16 V  [2917]  (hidden comment: 220u)
C10  voltage rated: 16 V  [2917]  (hidden comment: 220u)
C11  voltage rated: 16 V  [2917]  (hidden comment: 220u)
C12  voltage rated: 16 V  [2917]  (hidden comment: 220u)
C13  voltage rated: 16 V  [2917]  (hidden comment: 220u)
C14  voltage rated: 16 V  [0603]  (hidden comment: 1u)
C15  voltage rated: 6.3 V  [1206 - POLAR MARKING]  (hidden comment: 100u)
C16  voltage rated: 10 V  [0603]  (hidden comment: 4.7u)
L1  10u  [CDRH2D18]
U4  LTC3588EDD-1#PBF  [QFN-10]

### Ports
CT1, CT2, PGOOD, VCAP

### Nets
GND: C9.2 C10.2 C11.2 C12.2 C13.2 C15.2 C16.2 U4.9(D0) U4.11(GND)
V_harvest: C15.1 L1.1 U4.6(OUT)
CT1: U4.2(PZ2) ; port CT1
CT2: U4.1(PZ1) ; port CT2
PGOOD: U4.10(PGOOD) ; port PGOOD
VCAP: C9.1 C10.1 C11.1 C12.1 C13.1 C14.1 U4.4(VIN) ; port VCAP
NetC14_2: C14.2 U4.3(CAP)
NetC16_1: C16.1 U4.7(VIN2) U4.8(D1)
NetL1_2: L1.2 U4.5(SW)

### Notes on the sheet
- Title
- Date:
- Author:
- Revision:
- Sheet
- of
- University of Michigan
- File:
- (in symbol F930J107MAA) +
- (in symbol T495X227K016ATE100) +

### Library data of the parts
C9-C13 = T495X227K016ATE100: 220µF ±10% Molded Tantalum Capacitors 16V; Manufacture: Kemet; ESR: 100m Ohm; tolerance: 10%; package: 2917; Supplier 1: Digi-Key; Supplier Part Number 1: 399-10409-1-ND; Value: 220u; Manufacturer Part Number: T495X227K016ATE100
C14 = C1608X7R1C105K080AC: as C1 on sheet charging; tolerance: 10%; package: 0603; Supplier 1: Digi-Key; Supplier Part Number 1: 445-1604-1-ND; Value: 1u; Temperature Coefficient: X7R; Manufacturer Part Number: C1608X7R1C105K080AC
C15 = F930J107MAA: 100µF ±20% Molded Tantalum Capacitors 6.3V 1206; Manufacture: AVX; ESR: 2 Ohm; tolerance: 20%; package: 1206; Supplier 1: Digi-Key; Supplier Part Number 1: 478-8155-1-ND; Value: 100u; Manufacturer Part Number: F930J107MAA
C16 = CGB3B1X5R1A475K055AC: as C4 on sheet charging; tolerance: 10%; package: 0603; Supplier 1: Digi-Key; Supplier Part Number 1: 445-7482-1-ND; Value: 4.7u; Temperature Coefficient: X5R; Manufacturer Part Number: CGB3B1X5R1A475K055AC
L1 = CDRH2D18/LDNP-100NC: 10µH Shielded Inductor 1A 180 mOhm Max Nonstandard; Manufacturer: Sumida; tolerance: 30%; DCR (Max): 180m; Supplier 1: Digi-Key; Supplier Part Number 1: 308-1959-1-ND; Value: 10u; Current Rating: 1 A; Manufacturer Part Number: CDRH2D18/LDNP-100NC
U4 = LTC3588EDD-1#PBF: Piezoelectric Energy Harvesting Power Supply; Supplier 1: Digi-Key; Supplier Part Number 1: LTC3588EDD-1#PBF-ND

## Sheet fram_rtc.SchDoc: Triumvi - FRAM/RTC
size Letter; Author: Ye-Sheng Kuo; Revision: 11; SheetNumber: 9; SheetTotal: 10
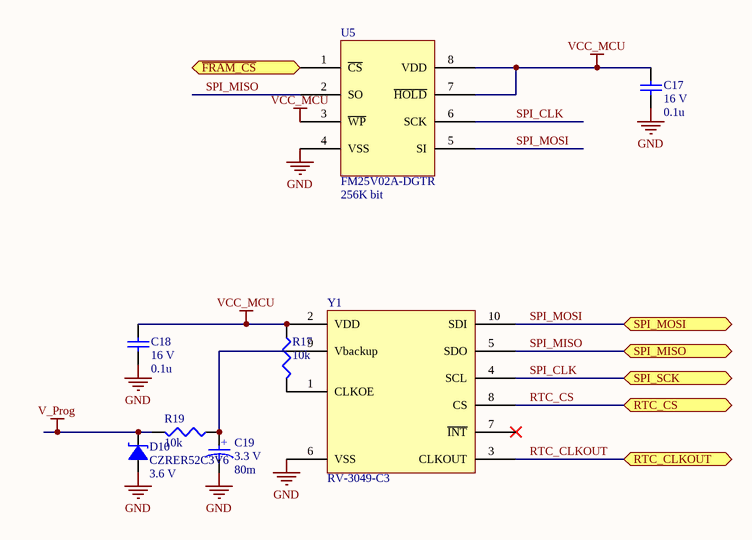
[diagram p6: fram_rtc.SchDoc]

### Parts
C17  voltage rated: 16 V  [0402]  (hidden comment: 0.1u)
C18  voltage rated: 16 V  [0402]  (hidden comment: 0.1u)
C19  voltage rated: 3.3 V  [XH414HG-IV01E]  (hidden comment: 80m)
D10  CZRER52C3V6  Zener Voltage: 3.6 V  [0503/SOD-723F]
R17  10k  [0402]
R19  10k  [0402]
U5  FM25V02A-DGTR  Size: 256K bit  [TDFN-8]
Y1  RV-3049-C3  [RV-3049-C3]

### Ports
RTC_CLKOUT, RTC_CS, SPI_MISO, SPI_MOSI, SPI_SCK, ~{FRAM_CS}

### Nets
GND: C17.2 C18.2 C19.2 D10.1 U5.4(VSS) Y1.6(VSS)
V_Prog: D10.2 R19.1
VCC_MCU: C17.1 C18.1 R17.2 U5.3(~{WP}) U5.7(~{HOLD}) U5.8(VDD) Y1.2(VDD)
RTC_CLKOUT: Y1.3(CLKOUT) ; port RTC_CLKOUT
RTC_CS: Y1.8(CS) ; port RTC_CS
SPI_CLK: U5.6(SCK) Y1.4(SCL) ; port SPI_SCK
SPI_MISO: U5.2(SO) Y1.5(SDO) ; port SPI_MISO
SPI_MOSI: U5.5(SI) Y1.10(SDI) ; port SPI_MOSI
NetC19_1: C19.1 R19.2 Y1.9(Vbackup)
NetR17_1: R17.1 Y1.1(CLKOE)
NetU5_1: U5.1(~{CS}) ; port ~{FRAM_CS}

Not connected (* = marked no-connect by the designer): Y1 7(~{INT})*

### Notes on the sheet
- Title
- Date:
- Author:
- Revision:
- Sheet
- of
- University of Michigan
- File:
- (in symbol XH414HG-IV01E) +

### Library data of the parts
C17 C18 = GRM155R71C104KA88D: as C28 on sheet mcu; tolerance: 10%; package: 0402; Supplier 1: Digi-Key; Supplier Part Number 1: 490-3261-1-ND; Value: 0.1u; Temperature Coefficient: X7R; Manufacturer Part Number: GRM155R71C104KA88D
C19 = XH414HG-IV01E: 80mF (EDLC) Supercapacitor 3.3V Coin; Manufacture: Seiko Instruments; Supplier 1: Digi-Key; Supplier Part Number 1: 728-1050-1-ND; Value: 80m; Manufacturer Part Number: XH414HG-IV01E
D10 = CZRER52C3V6: Zener Diode 3.6V 150mW ±5% Surface Mount 0503 (1308 Metric); Manufacturer: Comchip Technology; Forward Voltage @ If: 900 mV @ 10 mA; reverse current: 15 uA @ 1 V; Supplier 1: Digi-Key; Supplier Part Number 1: 641-1232-1-ND; Manufacturer Part Number: CZRER52C3V6; diode type: Zener; power: 150 mW
R17 R19 = CRCW040210K0FKED: as R9 on sheet config; Tolerance: 1%; Power: 1/16 W; Supplier 1: Digi-Key; Supplier Part Number 1: 541-10.0KLCT-ND; package: 0402; value: 10k; Manufacturer Part Number: CRCW040210K0FKED
U5 = FM25V02A-DGTR: 256-Kbit (32 K × 8) Serial (SPI) F-RAM; Manufacturer: Cypress Semiconductor; Manufactuere part number: FM25V02A-DGTR; Supplier 1: Digi-Key; Supplier Part Number 1: FM25V02A-DGTR-ND
Y1 = RV-3049-C3: Real Time Clock Module with SPI-Bus

## Sheet IV_sensing.SchDoc: Triumvi - Sensing
size Letter; Author: Ye-Sheng Kuo; Revision: 11; SheetNumber: 5; SheetTotal: 10
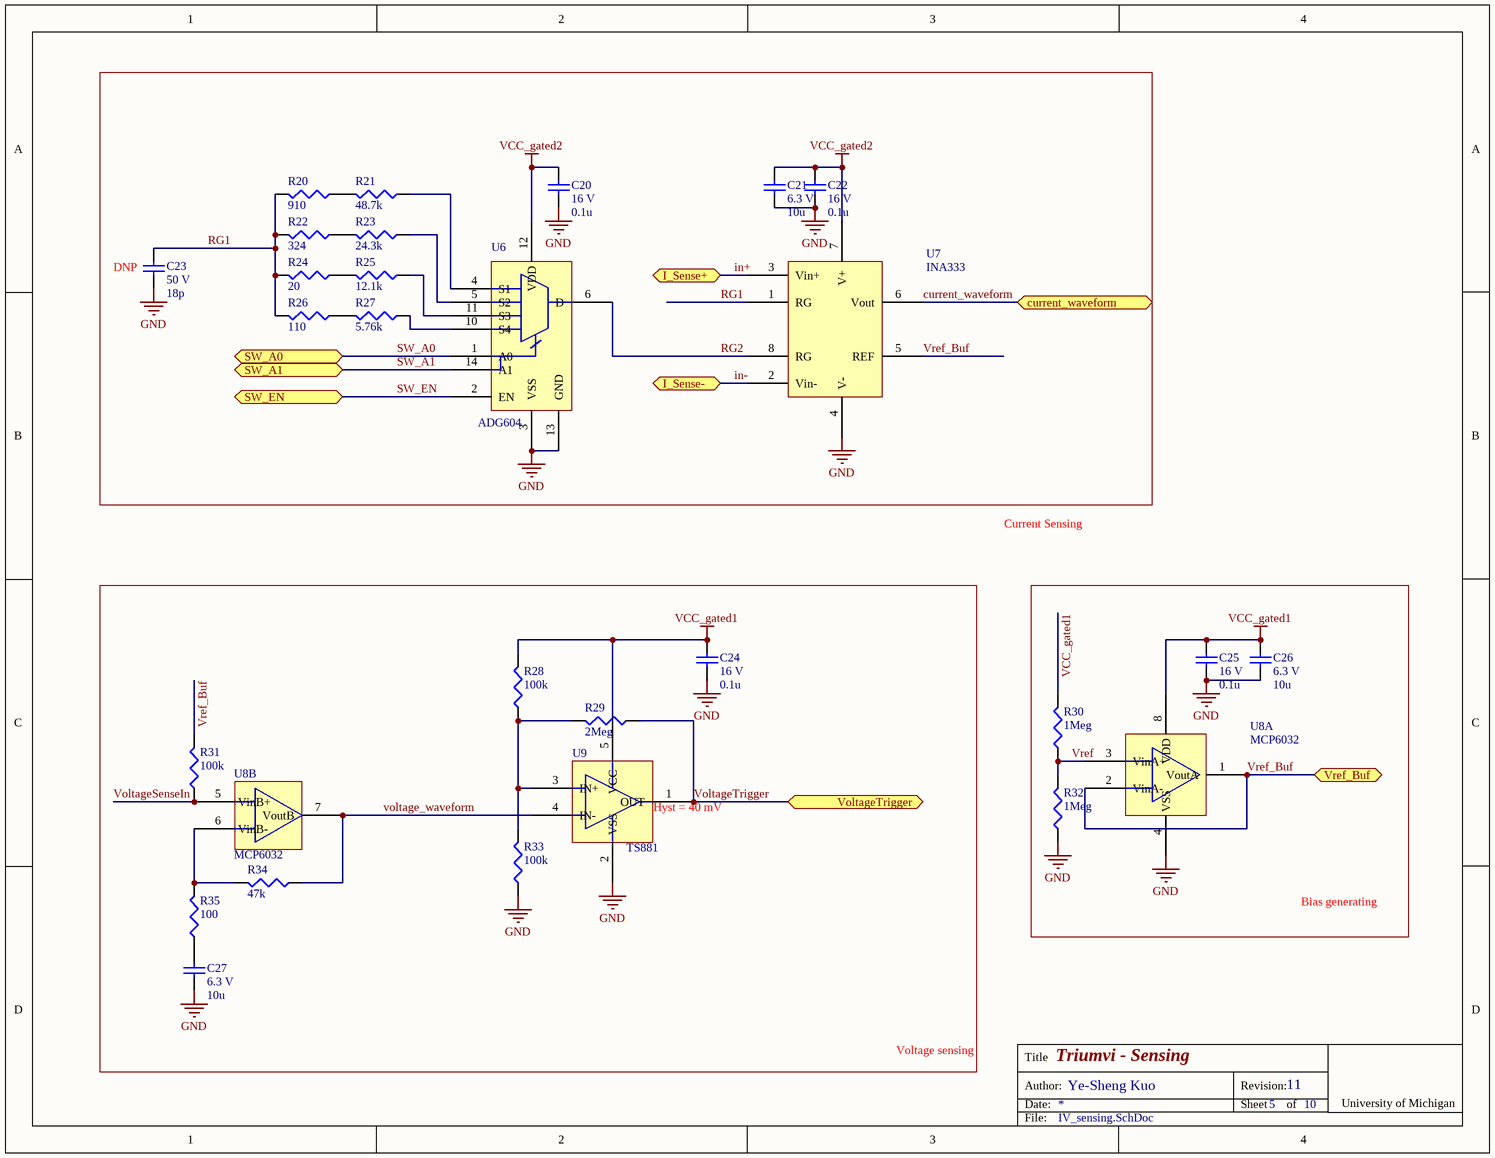
[diagram p7: IV_sensing.SchDoc]

### Parts
C20  voltage rated: 16 V  [0402]  (hidden comment: 0.1u)
C21  voltage rated: 6.3 V  [0603]  (hidden comment: 10u)
C22  voltage rated: 16 V  [0402]  (hidden comment: 0.1u)
C23  voltage rated: 50 V  [0402]  (hidden comment: 18p)
C24  voltage rated: 16 V  [0402]  (hidden comment: 0.1u)
C25  voltage rated: 16 V  [0402]  (hidden comment: 0.1u)
C26  voltage rated: 6.3 V  [0603]  (hidden comment: 10u)
C27  voltage rated: 6.3 V  [0603]  (hidden comment: 10u)
R20  910  [0402]
R21  48.7k  [0402]
R22  324  [0402]
R23  24.3k  [0402]
R24  20  [0402]
R25  12.1k  [0402]
R26  110  [0402]
R27  5.76k  [0402]
R28  100k  [0402]
R29  2Meg  [0402]
R30  1Meg  [0402]
R31  100k  [0402]
R32  1Meg  [0402]
R33  100k  [0402]
R34  47k  [0402]
R35  100  [0402]
U6  ADG604  [TSSOP-14]
U7  INA333  [MSOP-8]
U8  MCP6032  [MSOP-8]  (parts A,B of 2)
U9  TS881  [SC70-5]

### Blocks framed on the sheet
DNP: C20-C23 R20-R27 U6 U7
Bias generating: C25 C26 R30 R32 U8

### Ports
current_waveform, I_Sense+, I_Sense-, SW_A0, SW_A1, SW_EN, VoltageTrigger, Vref_Buf

### Nets
GND: C20.2 C21.2 C22.2 C23.2 C24.2 C25.2 C26.2 C27.2 R32.2 R33.2 U6.3(VSS) U6.13(GND) U7.4(V-) U8.4(VSS) U9.2(VSS)
VCC_gated1: C24.1 C25.1 C26.1 R28.1 R30.1 U8.8(VDD) U9.5(VCC)
VCC_gated2: C20.1 C21.1 C22.1 U6.12(VDD) U7.7(V+)
current_waveform: U7.6(Vout) ; port current_waveform
in+: U7.3(Vin+) ; port I_Sense+
in-: U7.2(Vin-) ; port I_Sense-
RG1: C23.1 R20.1 R22.1 R24.1 R26.1 U7.1(RG)
RG2: U6.6(D) U7.8(RG)
SW_A0: U6.1(A0) ; port SW_A0
SW_A1: U6.14(A1) ; port SW_A1
SW_EN: U6.2(EN) ; port SW_EN
voltage_waveform: R34.2 U8.7(VoutB) U9.4(IN-)
VoltageSenseIn: R31.2 U8.5(VinB+)
VoltageTrigger: R29.2 U9.1(OUT) ; port VoltageTrigger
Vref: R30.2 R32.1 U8.3(VinA+)
Vref_Buf: R31.1 U7.5(REF) U8.1(VoutA) U8.2(VinA-) ; port Vref_Buf
NetC27_1: C27.1 R35.2
NetR20_2: R20.2 R21.1
NetR21_2: R21.2 U6.4(S1)
NetR22_2: R22.2 R23.1
NetR23_2: R23.2 U6.5(S2)
NetR24_2: R24.2 R25.1
NetR25_2: R25.2 U6.11(S3)
NetR26_2: R26.2 R27.1
NetR27_2: R27.2 U6.10(S4)
NetR28_2: R28.2 R29.1 R33.1 U9.3(IN+)
NetR34_1: R34.1 R35.1 U8.6(VinB-)

### Notes on the sheet
- Current Sensing
- (near U9) Hyst = 40 mV
- Voltage sensing
- Title
- Date:
- Author:
- Revision:
- Sheet
- of
- University of Michigan
- File:

### Library data of the parts
C20 C22 C24 C25 = GRM155R71C104KA88D: as C28 on sheet mcu; tolerance: 10%; package: 0402; Supplier 1: Digi-Key; Supplier Part Number 1: 490-3261-1-ND; Value: 0.1u; Temperature Coefficient: X7R; Manufacturer Part Number: GRM155R71C104KA88D
C21 C26 C27 = C1608X5R0J106M080AB: 10µF ±20% 6.3V Ceramic Capacitor X5R 0603; Manufacture: TDK; tolerance: 20%; package: 0603; Supplier 1: Digi-Key; Supplier Part Number 1: 445-4112-1-ND; Value: 10u; Temperature Coefficient: X5R; Manufacturer Part Number: C1608X5R0J106M080AB
C23 = 500R07S180GV4T: 18pF ±2% 50V Ceramic Capacitor C0G, NP0 0402; Manufacture: Johanson Technology Inc.; Note: DNP; tolerance: 2%; package: 0402; Temperature Coefficient: C0G, NP0; Manufacturer Part Number: 500R07S180GV4T; Supplier 1: Digi-Key; Supplier Part Number 1: 712-1264-1-ND; Value: 18p
R20 = CRCW0402910RFKED: as R1 on sheet charging; package: 0402; Manufacturer Part Number: CRCW0402910RFKED; Power: 1/16 W; Tolerance: 1%; Supplier 1: Digi-Key; Supplier Part Number 1: 541-910LCT-ND; value: 910
R21 = RT0402DRD0748K7L: RES SMD 48.7K OHM 0.5% 1/16W 0402; Manufacturer: Yageo; Temperature Coefficient: 25 ppm/C; package: 0402; Manufacturer Part Number: RT0402DRD0748K7L; Power: 1/16 W; Tolerance: 0.5%; Supplier 1: Digi-Key; Supplier Part Number 1: 311-2188-1-ND; value: 48.7k
R22 = CRCW0402324RFKED: as R8 on sheet config; package: 0402; Manufacturer Part Number: CRCW0402324RFKED; Power: 1/16 W; Tolerance: 1%; Supplier 1: Digi-Key; Supplier Part Number 1: 541-324LCT-ND; value: 324
R23 = RC0402FR-0724K3L: RES SMD 24.3K OHM 0.5% 1/16W 0402; Manufacturer: Yageo; Temperature Coefficient: 100 ppm/C; Tolerance: 1%; package: 0402; Manufacturer Part Number: RC0402FR-0724K3L; Power: 1/16 W; Supplier 1: Digi-Key; Supplier Part Number 1: YAG3071CT-ND; value: 24.3k
R24 = CRCW040220R0FKED: RES SMD 20 OHM 1% 1/16W 0402; Manufacturer: Vishay Dale; Temperature Coefficient: 100 ppm/C; package: 0402; Manufacturer Part Number: CRCW040220R0FKED; Power: 1/16 W; Tolerance: 1%; Supplier 1: Digi-Key; Supplier Part Number 1: 541-20.0LCT-ND; value: 20
R25 = CRCW040212K1FKED: RES SMD 12.1K OHM 1% 1/16W 0402; Manufacturer: Vishay Dale; Temperature Coefficient: 100 ppm/C; package: 0402; Manufacturer Part Number: CRCW040212K1FKED; Power: 1/16 W; Tolerance: 1%; Supplier 1: Digi-Key; Supplier Part Number 1: 541-12.1KLCT-ND; value: 12.1k
R26 = CRCW0402110RFKED: as R6 on sheet config; package: 0402; Manufacturer Part Number: CRCW0402110RFKED; Power: 1/16 W; Tolerance: 1%; Supplier 1: Digi-Key; Supplier Part Number 1: 541-110LCT-ND; value: 110
R27 = RC0402FR-075K76L: RES SMD 5.76K OHM 0.5% 1/16W 0402; Manufacturer: Yageo; Temperature Coefficient: 100 ppm/C; Tolerance: 1%; package: 0402; Manufacturer Part Number: RC0402FR-075K76L; Power: 1/16 W; Supplier 1: Digi-Key; Supplier Part Number 1: YAG3196CT-ND; value: 5.76k
R28 R31 R33 = CRCW0402100KFKED: as R5 on sheet config; Tolerance: 1%; Power: 1/16 W; Supplier 1: Digi-Key; Supplier Part Number 1: 541-100KLCT-ND; package: 0402; value: 100k; Manufacturer Part Number: CRCW0402100KFKED
R29 = CRCW04022M00FKED: RES SMD 2M OHM 1% 1/16W 0402; Manufacturer: Vishay Dale; Temperature Coefficient: 100 ppm/C; Tolerance: 1%; Power: 1/16 W; package: 0402; Supplier 1: Digi-Key; Supplier Part Number 1: 541-2.00MLCT-ND; value: 2Meg; Manufacturer Part Number: CRCW04022M00FKED
R30 R32 = CRCW04021M00FKED: as R37 on sheet mcu; Tolerance: 1%; Power: 1/16 W; Supplier 1: Digi-Key; Supplier Part Number 1: 541-1.00MLCT-ND; package: 0402; value: 1Meg; Manufacturer Part Number: CRCW04021M00FKED
R34 = CRCW040247K0FKED: as R36 on sheet mcu; Tolerance: 1%; Power: 1/16 W; package: 0402; Supplier 1: Digi-Key; Supplier Part Number 1: 541-47.0KLCT-ND; value: 47k; Manufacturer Part Number: CRCW040247K0FKED
R35 = CRCW0402100RFKED: RES SMD 100 OHM 1% 1/16W 0402; Manufacturer: Vishay Dale; Temperature Coefficient: 100 ppm/C; Tolerance: 1%; Power: 1/16 W; package: 0402; Supplier 1: Digi-Key; Supplier Part Number 1: 541-100LCT-ND; value: 100; Manufacturer Part Number: CRCW0402100RFKED
U6 = ADG604: 1 pC Charge Injection, 100 pA Leakage  CMOS  5 V/5 V/3 V 4-Channel Multiplexer; Supplier 1: Digi-Key; Supplier Part Number 1: ADG604YRUZ-ND
U7 = INA333: Micro-Power (50uA), Zero-Drift, Rail-to-Rail Out  Instrumentation Amplifier; Supplier 1: Digi-Key; Supplier Part Number 1: 296-23564-1-ND
U8 = MCP6032: 0.9 µA, High Precision Op Amps; Supplier 1: Digi-Key; Supplier Part Number 1: MCP6032-E/MS-ND
U9 = TS881: Rail-to-rail 0.9 V nanopower comparator; Supplier 1: Digi-Key; Supplier Part Number 1: 497-13217-1-ND

## Sheet power_generation.SchDoc: Triumvi - Power
size Letter; Author: Ye-Sheng Kuo; Revision: 11; SheetNumber: 2; SheetTotal: 10
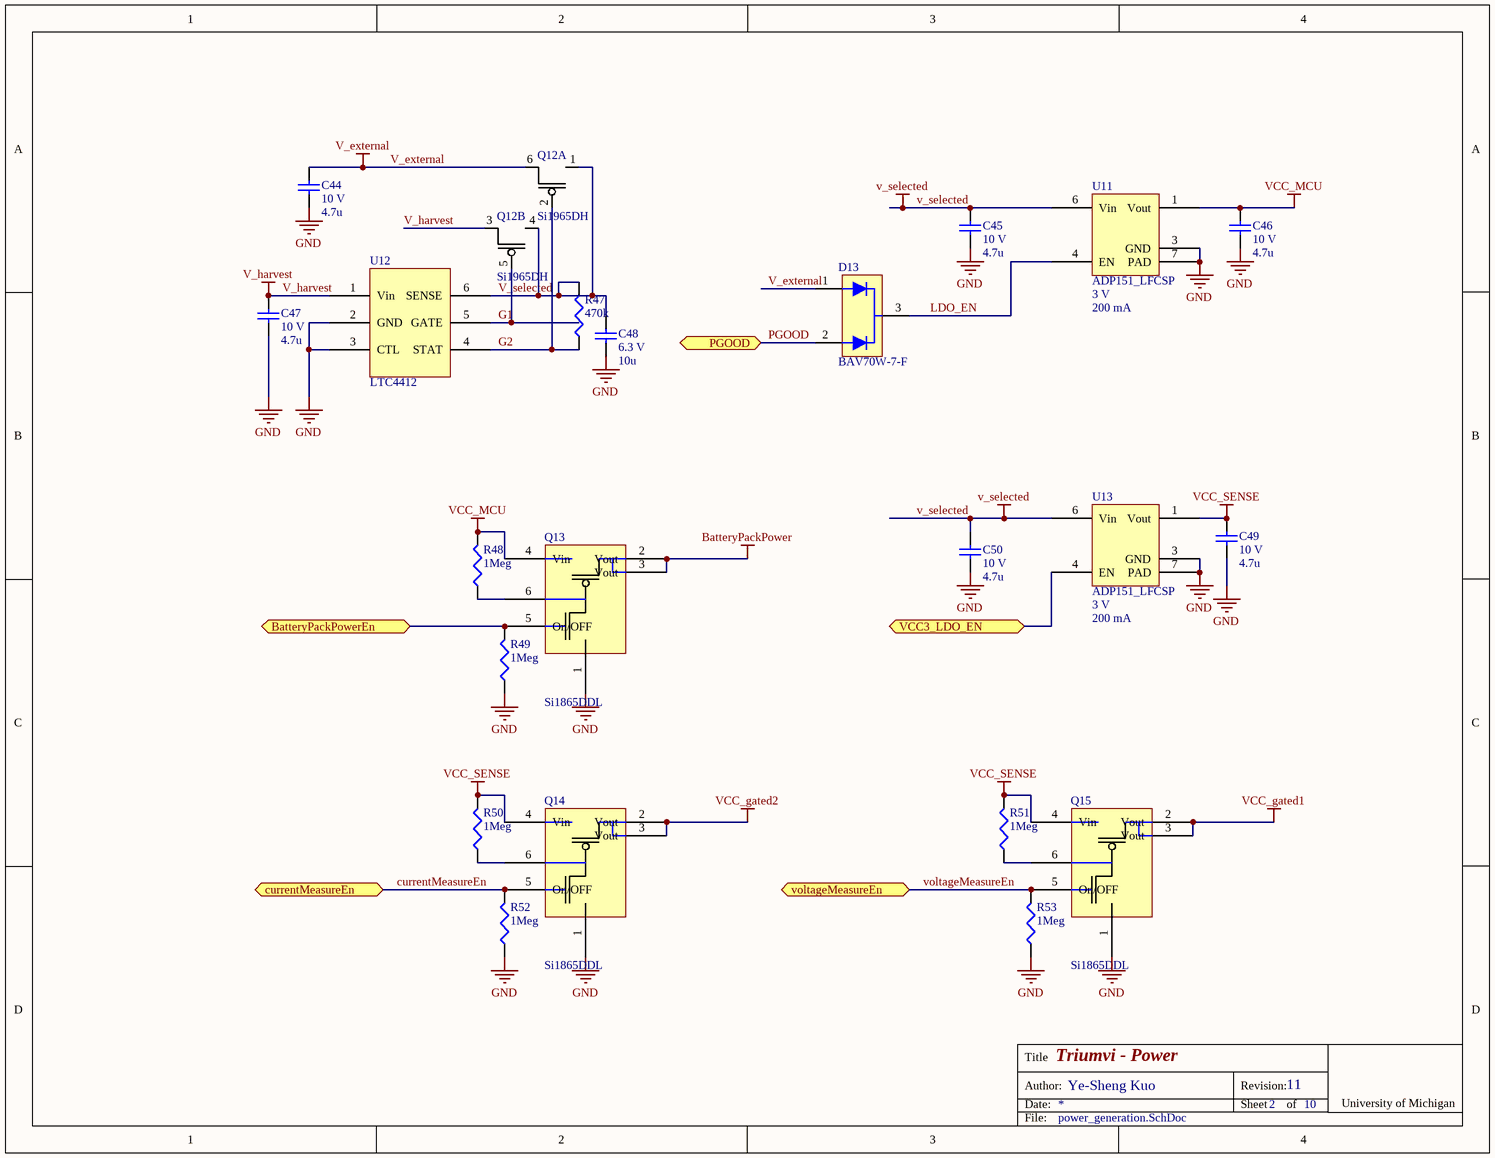
[diagram p8: power_generation.SchDoc]

### Parts
C44  voltage rated: 10 V  [0603]  (hidden comment: 4.7u)
C45  voltage rated: 10 V  [0603]  (hidden comment: 4.7u)
C46  voltage rated: 10 V  [0603]  (hidden comment: 4.7u)
C47  voltage rated: 10 V  [0603]  (hidden comment: 4.7u)
C48  voltage rated: 6.3 V  [0603]  (hidden comment: 10u)
C49  voltage rated: 10 V  [0603]  (hidden comment: 4.7u)
C50  voltage rated: 10 V  [0603]  (hidden comment: 4.7u)
D13  BAV70W-7-F  [SOT323]
Q12  Si1965DH  [SC70-6]  (parts A,B of 2)
Q13  Si1865DDL  [SC70-6]
Q14  Si1865DDL  [SC70-6]
Q15  Si1865DDL  [SC70-6]
R47  470k  [0402]
R48  1Meg  [0402]
R49  1Meg  [0402]
R50  1Meg  [0402]
R51  1Meg  [0402]
R52  1Meg  [0402]
R53  1Meg  [0402]
U11  ADP151_LFCSP  Voltage: 3 V  Current: 200 mA  [CP-6-3]
U12  LTC4412  [TSOT-23]
U13  ADP151_LFCSP  Voltage: 3 V  Current: 200 mA  [CP-6-3]

### Ports
BatteryPackPowerEn, currentMeasureEn, PGOOD, VCC3_LDO_EN, voltageMeasureEn

### Nets
BatteryPackPower: Q13.2(Vout) Q13.3(Vout)
GND: C44.2 C45.2 C46.2 C47.2 C48.2 C49.2 C50.2 Q13.1(S1) Q14.1(S1) Q15.1(S1) R49.2 R52.2 R53.2 U11.3(GND) U11.7(PAD) U12.2(GND) U12.3(CTL) U13.3(GND) U13.7(PAD)
V_external: C44.1 D13.1 Q12.6(D1)
V_harvest: C47.1 Q12.3(D2) U12.1(Vin)
v_selected: C45.1 C48.1 C50.1 Q12.1(S1) Q12.4(S2) R47.1 U11.6(Vin) U12.6(SENSE) U13.6(Vin)
VCC_gated1: Q15.2(Vout) Q15.3(Vout)
VCC_gated2: Q14.2(Vout) Q14.3(Vout)
VCC_MCU: C46.1 Q13.4(Vin) R48.1 U11.1(Vout)
VCC_SENSE: C49.1 Q14.4(Vin) Q15.4(Vin) R50.1 R51.1 U13.1(Vout)
currentMeasureEn: Q14.5(On/OFF) R52.1 ; port currentMeasureEn
G1: Q12.5(G2) U12.5(GATE)
G2: Q12.2(G1) R47.2 U12.4(STAT)
LDO_EN: D13.3 U11.4(EN)
PGOOD: D13.2 ; port PGOOD
voltageMeasureEn: Q15.5(On/OFF) R53.1 ; port voltageMeasureEn
NetQ13_5: Q13.5(On/OFF) R49.1 ; port BatteryPackPowerEn
NetQ13_6: Q13.6(D1) R48.2
NetQ14_6: Q14.6(D1) R50.2
NetQ15_6: Q15.6(D1) R51.2
NetU10_11: U13.4(EN) ; port VCC3_LDO_EN

### Notes on the sheet
- Title
- Date:
- Author:
- Revision:
- Sheet
- of
- University of Michigan
- File:

### Library data of the parts
C44-C47 C49 C50 = CGB3B1X5R1A475K055AC: as C4 on sheet charging; tolerance: 10%; package: 0603; Supplier 1: Digi-Key; Supplier Part Number 1: 445-7482-1-ND; Value: 4.7u; Temperature Coefficient: X5R; Manufacturer Part Number: CGB3B1X5R1A475K055AC
C48 = C1608X5R0J106M080AB: as C21 on sheet IV_sensing; tolerance: 20%; package: 0603; Temperature Coefficient: X5R; Supplier 1: Digi-Key; Supplier Part Number 1: 445-4112-1-ND; Value: 10u; Manufacturer Part Number: C1608X5R0J106M080AB
D13 = BAV70W-7-F: Diode Array 1 Pair Common Cathode Standard 75V 150mA Surface Mount SC-70, SOT-323; Manufacturer: Diodes Incorporated; Forward Voltage @ If: 1.25 V @ 150 mA; Supplier 1: Digi-Key; Supplier Part Number 1: BAV70W-FDICT-ND; Manufacturer Part Number: BAV70W-7-F; current: 150 mA; reverse voltage: 75 V; diode type: Standard
Q12 = Si1965DH: Dual P-Channel 12 V (D-S) MOSFET; Supplier 1: Digi-Key; Supplier Part Number 1: SI1965DH-T1-GE3CT-ND
Q13-Q15 = Si1865DDL: Load Switch with Level-Shift; Supplier 1: Digi-Key; Supplier Part Number 1: SI1865DDL-T1-GE3CT-ND
R47 = CRCW0402470KJNED: RES SMD 470K OHM 5% 1/16W 0402; Manufacturer: Vishay Dale; Temperature Coefficient: 100 ppm/C; Tolerance: 5%; Power: 1/16 W; package: 0402; Supplier 1: Digi-Key; Supplier Part Number 1: 541-470KJCT-ND; value: 470k; Manufacturer Part Number: CRCW0402470KJNED
R48-R53 = CRCW04021M00FKED: as R37 on sheet mcu; Tolerance: 1%; Power: 1/16 W; Supplier 1: Digi-Key; Supplier Part Number 1: 541-1.00MLCT-ND; package: 0402; value: 1Meg; Manufacturer Part Number: CRCW04021M00FKED
U11 U13 = ADP151_LFCSP: Ultralow Noise, 200 mA,  CMOS Linear Regulator; Supplier 1: Digi-Key; Supplier Part Number 1: ADP151ACPZ-3.0-R7CT-ND
U12 = LTC4412: Low Loss PowerPath Controller in ThinSOT; Supplier 1: Digi-Key; Supplier Part Number 1: LTC4412ES6#TRMPBFCT-ND

## Sheet programming_header.SchDoc: Triumvi - Programming
size Letter; Author: Ye-Sheng Kuo; Revision: 11; SheetNumber: 10; SheetTotal: 10
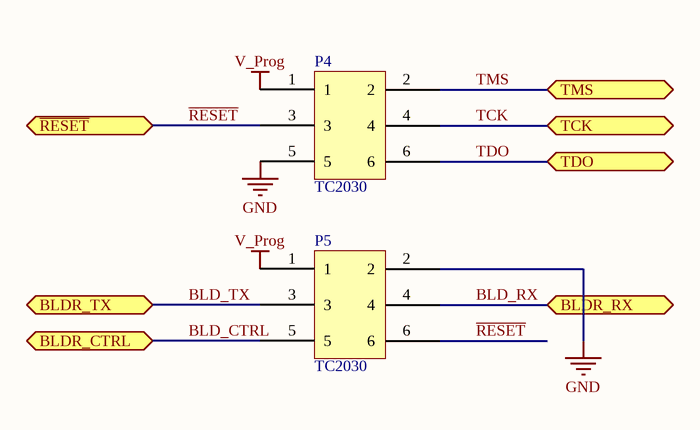
[diagram p9: programming_header.SchDoc]

### Parts
P4  TC2030  [TC2030-IDC-NLFP]
P5  TC2030  [TC2030-IDC-NLFP]

### Ports
BLDR_CTRL, BLDR_RX, BLDR_TX, TCK, TDO, TMS, ~{RESET}

### Nets
GND: P4.5 P5.2
V_Prog: P4.1 P5.1
BLD_CTRL: P5.5 ; port BLDR_CTRL
BLD_RX: P5.4 ; port BLDR_RX
BLD_TX: P5.3 ; port BLDR_TX
~{RESET}: P4.3 P5.6 ; port ~{RESET}
TCK: P4.4 ; port TCK
TDO: P4.6 ; port TDO
TMS: P4.2 ; port TMS

### Notes on the sheet
- Title
- Date:
- Author:
- Revision:
- Sheet
- of
- University of Michigan
- File:

### Library data of the parts
P4 P5 = TC2030: TC2030-MCP-NL; Note: Not a part

## Nets that join several sheets
BatteryPackPower: config (11 pins), power_generation (Q13.2 Q13.3)
GND: mcu (27 pins), charging (9 pins), config (12 pins), CT_switch (Q6.2 Q7.2 Q8.2 Q9.2), energy_harvesting (9 pins), fram_rtc (6 pins), IV_sensing (15 pins), power_generation (19 pins), programming_header (P4.5 P5.2)
V_Batt: charging (C5.1 Q1.2 U2.3), config (P1.4)
V_external: charging (D3.2 Q1.3), power_generation (C44.1 D13.1 Q12.6)
V_harvest: charging (C2.2 D1.2 U1.5), energy_harvesting (C15.1 L1.1 U4.6), power_generation (C47.1 Q12.3 U12.1)
V_Prog: charging (D1.1 D3.1 Q1.1 R3.1), fram_rtc (D10.2 R19.1), programming_header (P4.1 P5.1)
VCC_gated1: IV_sensing (7 pins), power_generation (Q15.2 Q15.3)
VCC_gated2: IV_sensing (5 pins), power_generation (Q14.2 Q14.3)
VCC_MCU: mcu (23 pins), fram_rtc (7 pins), power_generation (C46.1 Q13.4 R48.1 U11.1)
VCC_SENSE: mcu (U10.23), power_generation (6 pins)
BatteryPackDetect: mcu (U10.52), config (R5.2)
BLD_CTRL: mcu (U10.18), programming_header (P5.5)
BLD_RX: mcu (U10.16), programming_header (P5.4)
BLD_TX: mcu (U10.17), programming_header (P5.3)
CT1: CT_switch (D6.3 D8.3), energy_harvesting (U4.2)
CT2: CT_switch (D5.3 D7.3), energy_harvesting (U4.1)
current_waveform: mcu (U10.19), IV_sensing (U7.6)
currentMeasureEn: mcu (U10.13), CT_switch (Q6.1 Q7.1 Q8.1 Q9.1), power_generation (Q14.5 R52.1)
EXT_VOLT_SEL: mcu (U10.49), config (P1.2)
EXT_VOLT_WAVE: mcu (U10.21), config (P1.3)
I2C_SCL: mcu (U10.53), config (R10.2 U3.25)
I2C_SDA: mcu (U10.54), config (R9.2 U3.24)
in+: CT_switch (D5.1 Q4.3 R16.1), IV_sensing (U7.3)
in-: CT_switch (D6.1 Q2.3 R16.2), IV_sensing (U7.2)
NetQ13_5: mcu (U10.6), power_generation (Q13.5 R49.1)
NetR4_1: mcu (U10.27), charging (R4.1 U1.3)
NetU5_1: mcu (U10.26), fram_rtc (U5.1)
NetU10_11: mcu (U10.11), power_generation (U13.4)
PGOOD: energy_harvesting (U4.10), power_generation (D13.2)
~{RDY_IN}: mcu (D12.2 Q10.5), config (P2.2 P3.2)
~{RESET}: mcu (R45.2), programming_header (P4.3 P5.6)
RTC_CLKOUT: mcu (U10.44), fram_rtc (Y1.3)
RTC_CS: mcu (U10.30), fram_rtc (Y1.8)
SPI_CLK: mcu (U10.51), fram_rtc (U5.6 Y1.4)
SPI_MISO: mcu (U10.5), fram_rtc (U5.2 Y1.5)
SPI_MOSI: mcu (U10.50), fram_rtc (U5.5 Y1.10)
SW_A0: mcu (U10.7), IV_sensing (U6.1)
SW_A1: mcu (U10.8), IV_sensing (U6.14)
SW_EN: mcu (U10.25), IV_sensing (U6.2)
TCK: mcu (U10.47), programming_header (P4.4)
TDO: mcu (Q10.3 R37.2 U10.48), programming_header (P4.6)
TMS: mcu (U10.46), programming_header (P4.2)
VCAP: mcu (R36.1), config (P2.3 P3.3), energy_harvesting (7 pins)
VCAP_LOOPBACK: mcu (Q10.2 R43.1), config (P2.4 P3.4)
voltageMeasureEn: mcu (U10.14), power_generation (Q15.5 R53.1)
VoltageTrigger: mcu (U10.12), IV_sensing (R29.2 U9.1)
Vref_Buf: mcu (U10.20), IV_sensing (R31.1 U7.5 U8.1 U8.2)